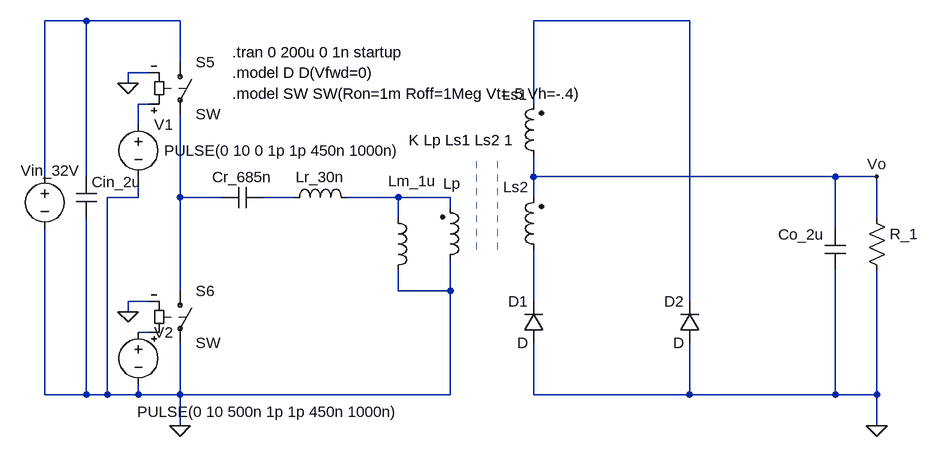
[diagram p0: schematic Half_Half_LLC_Schematic.asc]
Half_Half_LLC_Schematic.asc, the LTspice schematic file:
Version 4
SHEET 1 1396 1028
WIRE -32 32 -96 32
WIRE 112 32 -32 32
WIRE 896 32 656 32
WIRE 112 96 112 32
WIRE 64 112 32 112
WIRE 32 128 32 112
WIRE 64 160 48 160
WIRE 656 160 656 32
WIRE 48 192 48 160
WIRE -96 272 -96 32
WIRE -32 272 -32 32
WIRE 656 272 656 240
WIRE 1120 272 656 272
WIRE 1184 272 1120 272
WIRE 48 304 48 272
WIRE 48 304 0 304
WIRE 112 304 112 176
WIRE 176 304 112 304
WIRE 288 304 240 304
WIRE 448 304 368 304
WIRE 528 304 448 304
WIRE 656 304 656 272
WIRE 528 320 528 304
WIRE 448 336 448 304
WIRE 1184 336 1184 272
WIRE 1120 352 1120 272
WIRE 112 448 112 304
WIRE 448 448 448 416
WIRE 528 448 528 400
WIRE 528 448 448 448
WIRE 64 464 32 464
WIRE 656 464 656 384
WIRE 896 464 896 32
WIRE 32 480 32 464
WIRE 64 512 48 512
WIRE -96 608 -96 352
WIRE -32 608 -32 336
WIRE -32 608 -96 608
WIRE 0 608 0 304
WIRE 0 608 -32 608
WIRE 48 608 48 592
WIRE 48 608 0 608
WIRE 112 608 112 528
WIRE 112 608 48 608
WIRE 528 608 528 448
WIRE 528 608 112 608
WIRE 656 608 656 528
WIRE 896 608 896 528
WIRE 896 608 656 608
WIRE 1120 608 1120 416
WIRE 1120 608 896 608
WIRE 1184 608 1184 416
WIRE 1184 608 1120 608
WIRE 112 656 112 608
WIRE 1184 656 1184 608
FLAG 112 656 0
FLAG 1184 656 0
FLAG 1184 272 Vo
FLAG 32 128 0
FLAG 32 480 0
SYMBOL ind2 672 400 R180
WINDOW 0 24 112 Left 2
WINDOW 3 41 58 Invisible 2
SYMATTR InstName Ls2
SYMATTR Value 1
SYMBOL ind 272 320 R270
WINDOW 0 32 56 VTop 2
WINDOW 3 5 56 Invisible 2
SYMATTR InstName Lr_30n
SYMATTR Value 30n
SYMBOL cap 240 288 R90
WINDOW 0 0 32 VBottom 2
WINDOW 3 32 32 Invisible 2
SYMATTR InstName Cr_685n
SYMATTR Value 685n
SYMBOL ind2 512 416 M180
WINDOW 0 5 133 Left 2
WINDOW 3 38 54 Invisible 2
SYMATTR InstName Lp
SYMATTR Value 1
SYMBOL voltage -96 256 R0
WINDOW 0 -37 7 Left 2
WINDOW 3 24 96 Invisible 2
SYMATTR InstName Vin_32V
SYMATTR Value 32
SYMBOL cap 1104 352 R0
WINDOW 3 24 56 Invisible 2
WINDOW 0 -72 9 Left 2
SYMATTR Value 2µ
SYMATTR InstName Co_2u
SYMBOL res 1168 320 R0
WINDOW 3 36 76 Invisible 2
SYMATTR Value 1
SYMATTR InstName R_1
SYMBOL cap -48 272 R0
WINDOW 3 24 56 Invisible 2
SYMATTR Value 2µ
SYMATTR InstName Cin_2u
SYMBOL ind 432 320 R0
WINDOW 0 0 -41 Left 2
WINDOW 3 36 80 Invisible 2
SYMATTR InstName Lm_1u
SYMATTR Value 1µ
SYMBOL ind2 672 256 R180
WINDOW 0 25 110 Left 2
WINDOW 3 41 58 Invisible 2
SYMATTR InstName Ls1
SYMATTR Value 1
SYMBOL sw 112 80 R0
SYMATTR InstName S5
SYMBOL sw 112 432 R0
SYMATTR InstName S6
SYMBOL diode 672 528 R180
WINDOW 0 24 64 Left 2
WINDOW 3 24 0 Left 2
SYMATTR InstName D1
SYMBOL diode 912 528 R180
WINDOW 0 24 64 Left 2
WINDOW 3 24 0 Left 2
SYMATTR InstName D2
SYMBOL voltage 48 176 R0
WINDOW 3 40 56 Left 2
SYMATTR Value PULSE(0 10 0 1p 1p 450n 1000n)
SYMATTR InstName V1
SYMBOL voltage 48 496 R0
WINDOW 3 -2 138 Left 2
SYMATTR Value PULSE(0 10 500n 1p 1p 450n 1000n)
SYMATTR InstName V2
TEXT 464 216 Left 2 !K Lp Ls1 Ls2 1
TEXT 192 80 Left 2 !.tran 0 200u 0 1n startup
TEXT 192 112 Left 2 !.model D D(Vfwd=0)
TEXT 192 144 Left 2 !.model SW SW(Ron=1m Roff=1Meg Vt=.5 Vh=-.4)
LINE Normal 568 248 568 384 2
LINE Normal 600 248 600 384 2

The netlist it stands for:
* Half_Half_LLC_Schematic.asc
Ls2 N007 Vo 1
Lr_30n N005 N006 30n
Cr_685n N005 N004 685n
Lp 0 N006 1
Vin_32V N001 0 32
Co_2u Vo 0 2µ
R_1 Vo 0 1
Cin_2u N001 0 2µ
Lm_1u N006 0 1µ
Ls1 Vo N002 1
S5 N001 N004 N003 0 SW
S6 N004 0 N008 0 SW
D1 0 N007 D
D2 0 N002 D
V1 N003 0 PULSE(0 10 0 1p 1p 450n 1000n)
V2 N008 0 PULSE(0 10 500n 1p 1p 450n 1000n)
.model D D
.lib standard.dio
K Lp Ls1 Ls2 1
.tran 0 200u 0 1n startup
.model D D(Vfwd=0)
.model SW SW(Ron=1m Roff=1Meg Vt=.5 Vh=-.4)
.backanno
.end